# Altium project LimeSDR-XTRX_1v2.PrjPcb (part 7 of 9)
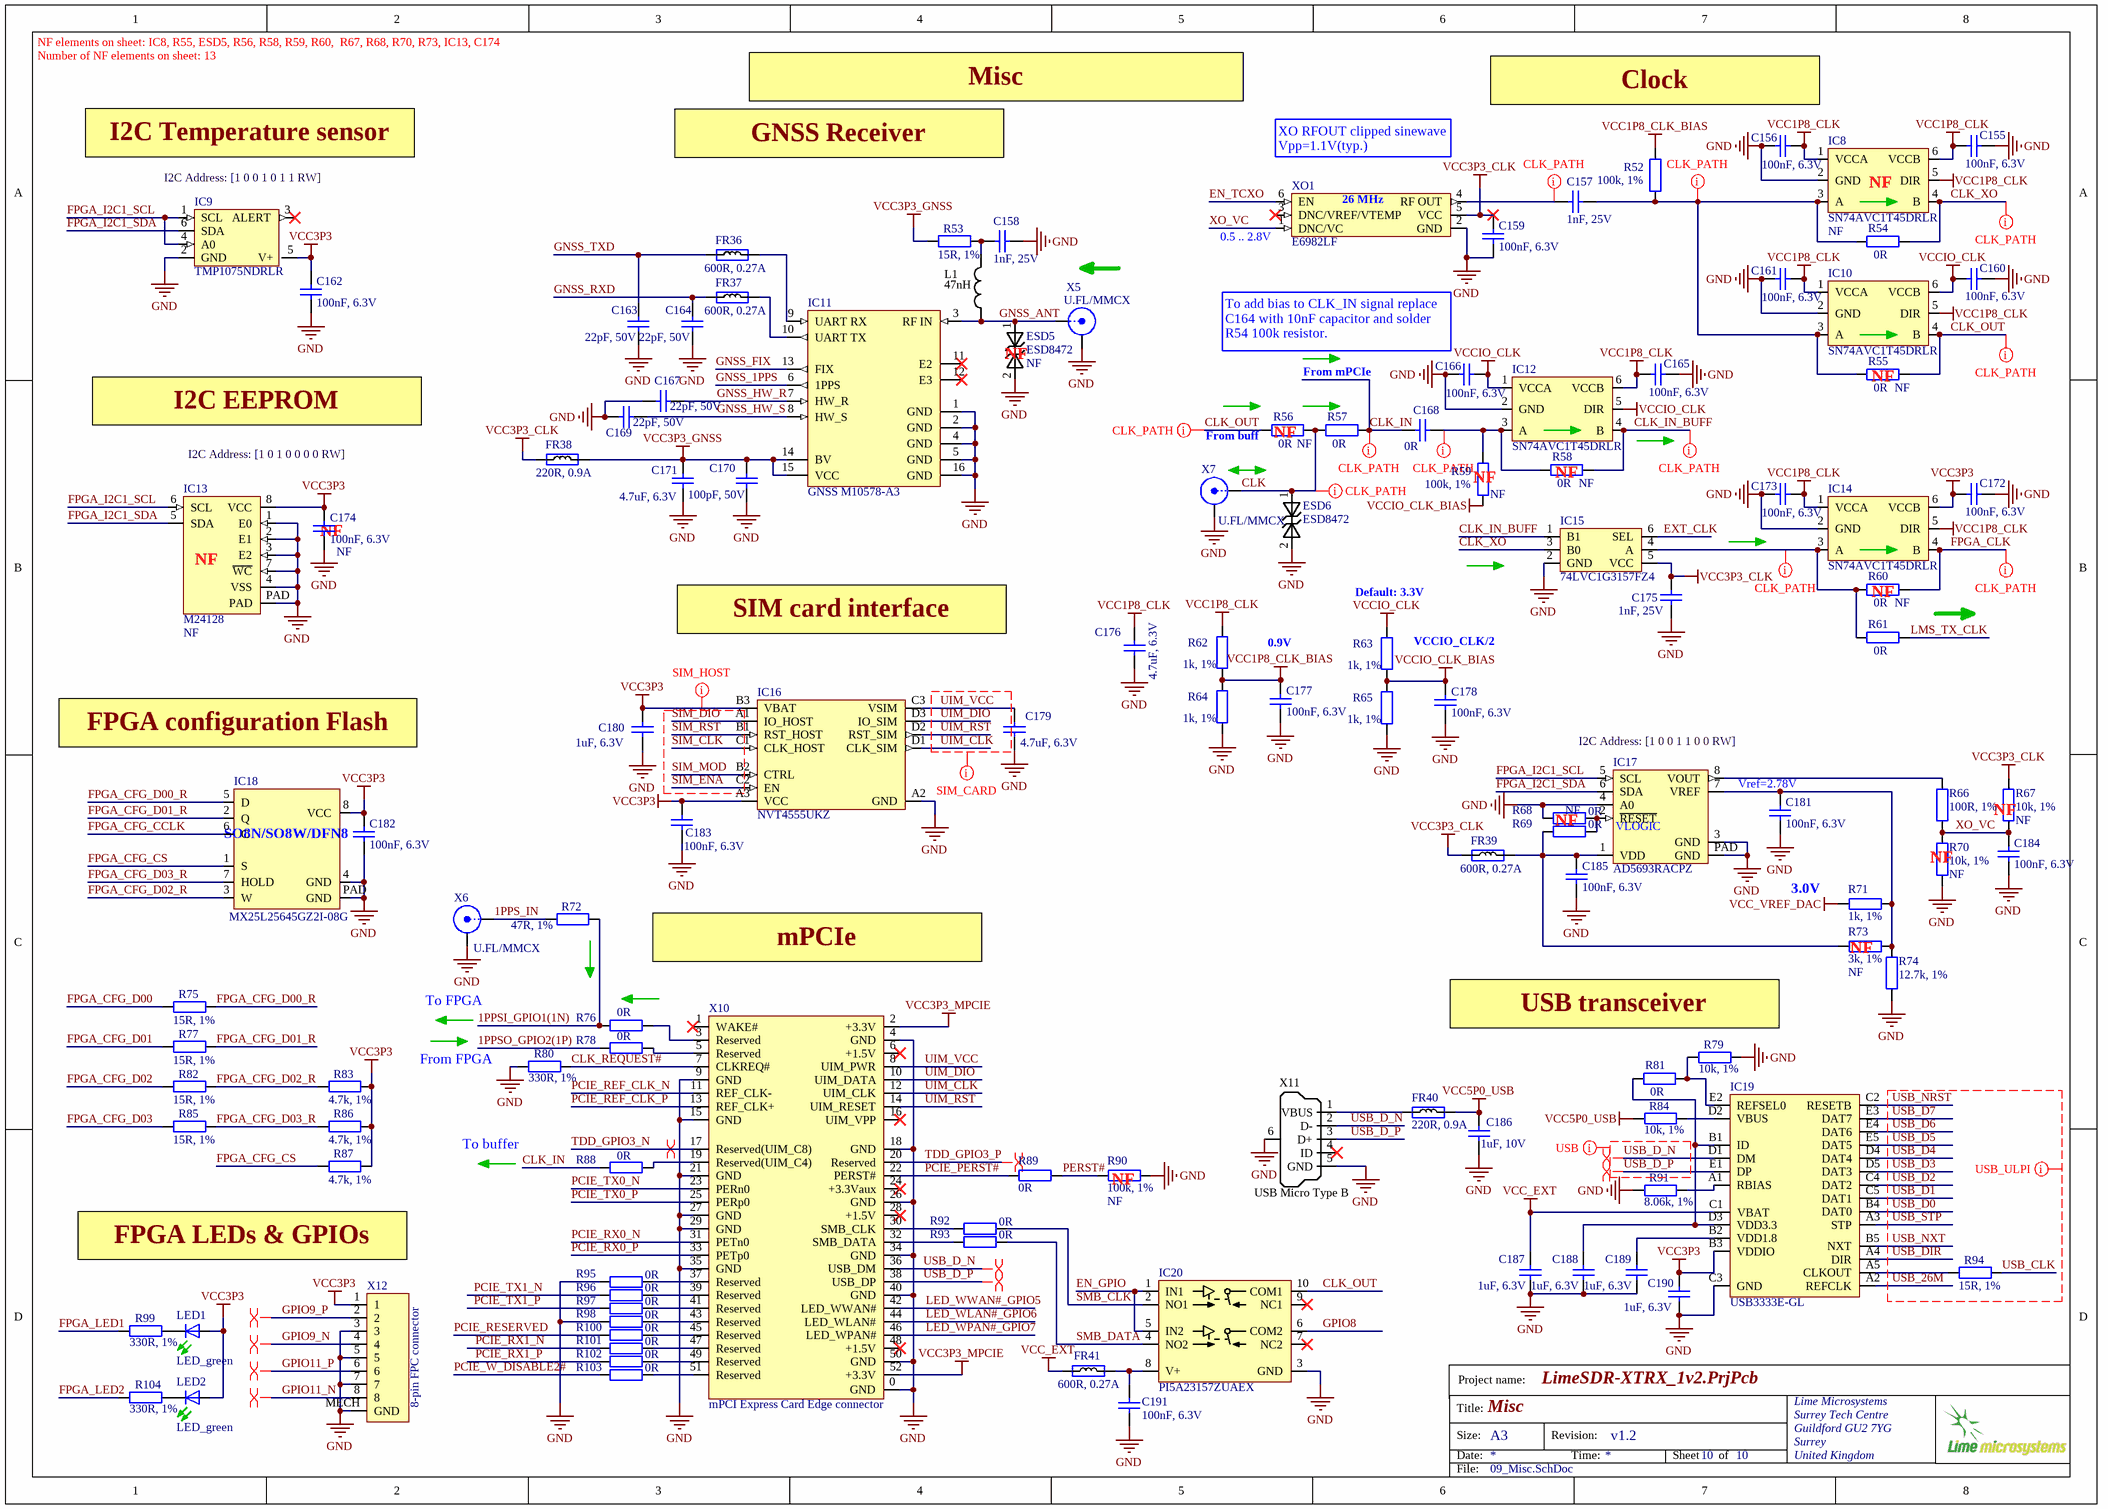
[diagram p111: 09_Misc.SchDoc]

## Sheet 09_Misc.SchDoc: Misc (continued)

### Library data of the parts (continued)
R91 = Res_0402: Manufacturer: Yageo; Manufacturer Part Number 1: RC0201FR-078K06L; Part Description: 8.06 kOhms ±1% 0.05W, 1/20W Chip Resistor 0201 (0603 Metric) Moisture Resistant Thick Film; Resistance: 8.06kR; Max Power Dissipation: 50mW; Temperature Coefficient: 200ppm/°C; Value: 8.06k, 1%; ComponentLink1URL: https://datasheet.ciiva.com/5924/1563626-5924912.pdf?src-supplier=Farnell; ComponentLink1Description: https://datasheet.ciiva.com/5924/1563626-5924912.pdf?src-supplier=Farnell; ComponentLink2URL: https://datasheet.ciiva.com/22661/1563626-22661319.pdf?src-supplier=Element14; ComponentLink2Description: https://datasheet.ciiva.com/22661/1563626-22661319.pdf?src-supplier=Element14; ComponentLink3URL: https://datasheet.ciiva.com/7660/1421516-7660807.pdf?src-supplier=Element14; ComponentLink3Description: https://datasheet.ciiva.com/7660/1421516-7660807.pdf?src-supplier=Element14; ComponentLink4URL: https://datasheet.ciiva.com/46391/1421516-46391339.pdf?src-supplier=Element14; ComponentLink4Description: https://datasheet.ciiva.com/46391/1421516-46391339.pdf?src-supplier=Element14; ComponentLink5URL: https://datasheet.ciiva.com/2467/pyu-r-int-thick-7-2467110.pdf?src-supplier=Digi-Key; ComponentLink5Description: https://datasheet.ciiva.com/2467/pyu-r-int-thick-7-2467110.pdf?src-supplier=Digi-Key; ComponentLink6URL: https://datasheet.ciiva.com/2467/pyu-r-int-thick-7-2467111.pdf?src-supplier=Digi-Key; ComponentLink6Description: https://datasheet.ciiva.com/2467/pyu-r-int-thick-7-2467111.pdf?src-supplier=Digi-Key; ComponentLink7URL: https://datasheet.ciiva.com/2467/pyu-r-int-thick-7-2467109.pdf?src-supplier=Digi-Key; ComponentLink7Description: https://datasheet.ciiva.com/2467/pyu-r-int-thick-7-2467109.pdf?src-supplier=Digi-Key; Supplier 1: Digi-Key; Supplier Part Number 1: YAG2831CT-ND; Stock 1: 99747; Pricing 1: 1=0,10000, 10=0,03700, 100=0,01500, 1000=0,00672, 2500=0,00583, 5000=0,00482 (USD); RoHS: Yes; Case/Package: 0201; Case Code (Metric): 0603; Case Code (Imperial): 0201; Min Operating Temperature: -55°C; Max Operating Temperature: 125°C; Tolerance: 1%; Packaging: Tape and Reel; Resistor Type: Thick Film; Number of Terminations: 2; Features: Moisture Resistant; Length: 0.024inch; Width: 0.012inch; Height: 0.01inch; Depth: 0.3mm; Military Standard: Not; RoHS Compliant: Yes; ComponentLink8URL: http://www.yageo.com/documents/recent/PYu-RC_Group_51_RoHS_L_9.pdf?src-supplier=Digi-Key; ComponentLink8Description: http://www.yageo.com/documents/recent/PYu-RC_Group_51_RoHS_L_9.pdf?src-supplier=Digi-Key; ComponentLink9URL: https://www.yageo.com/upload/media/product/productsearch/datasheet/rchip/PYu-RC_Group_51_RoHS_L_11.pdf?src-supplier=Digi-Key; ComponentLink9Description: https://www.yageo.com/upload/media/product/productsearch/datasheet/rchip/PYu-RC_Group_51_RoHS_L_11.pdf?src-supplier=Digi-Key
X5-X7 = RF_IF_connector: CONN UMC RCPT STR 50 OHM SMD; Manufacturer: Molex, LLC; Manufacturer Part Number 1: 0734120110; Part Description: Ultra Miniature Coaxial Connector Receptacle, Male Pin 50 Ohm Surface Mount Solder; Body Finish: Nickel; Body Material: Phosphor Bronze; Center Contact Material: Brass; Center Contact Plating: Gold; Connector Style: Ultra Miniature Coaxial; Connector Type: Jack, Male Pin; Contact Termination: Solder; Dielectric Material: Liquid Crystal Polymer (LCP); Frequency - Max: 6GHz; Impedance: 50 Ohm; Voltage Rating: 60V; Cable Group: -; Category: Connectors, Interconnects; Fastening Type: Snap-On; Features: -; Housing Color: Silver; Ingress Protection: -; Mounting Type: Surface Mount; Operating Temperature: -40°C ~ 90°C; Packaging: Cut Tape (CT); RoHS: RoHS Compliant; Shield Termination: Solder; Supplier 1: Digi-Key; Supplier Part Number 1: WM5587CT-ND
X10 = PCIe_MiniCard_fingers: PCIe MiniCard full or half size
X11 = USB_Micro_TypeB_47346-0001: Connector SMD USB Micro Type B; Part Description: USB - micro B USB 2.0 Receptacle Connector 5 Position Surface Mount, Right Angle; Manufacturer: Molex; Supplier 1: Digi-Key; Supplier Part Number 1: WM17141CT-ND; Manufacturer Part Number 1: 47346-0001; Stock 1: 48746; Pricing 1: 1=1,66000, 10=1,41200, 100=1,16660, 1000=0,92100 (USD); RoHS: Yes; ComponentLink1URL: https://datasheet.ciiva.com/30075/304740473460001-io-nectors-30075527.pdf?src-supplier=Onlinecomponents.com; ComponentLink1Description: https://datasheet.ciiva.com/30075/304740473460001-io-nectors-30075527.pdf?src-supplier=Onlinecomponents.com; ComponentLink2URL: https://datasheet.ciiva.com/22654/1630785-22654942.pdf?src-supplier=Element14; ComponentLink2Description: https://datasheet.ciiva.com/22654/1630785-22654942.pdf?src-supplier=Element14; ComponentLink3URL: https://datasheet.ciiva.com/16148/1700180473460001-io-nectors-16148917.pdf?src-supplier=Onlinecomponents.com; ComponentLink3Description: https://datasheet.ciiva.com/16148/1700180473460001-io-nectors-16148917.pdf?src-supplier=Onlinecomponents.com; ComponentLink4URL: https://datasheet.ciiva.com/11731/0900766b80dfe0a7-11731298.pdf?src-supplier=RSComponents; ComponentLink4Description: https://datasheet.ciiva.com/11731/0900766b80dfe0a7-11731298.pdf?src-supplier=RSComponents; ComponentLink5URL: https://datasheet.ciiva.com/1098/1698067-1098476.pdf?src-supplier=Element14; ComponentLink5Description: https://datasheet.ciiva.com/1098/1698067-1098476.pdf?src-supplier=Element14; ComponentLink6URL: https://datasheet.ciiva.com/4598/0473460001-io-connectors-146446-4598841.pdf?src-supplier=Mouser; ComponentLink6Description: https://datasheet.ciiva.com/4598/0473460001-io-connectors-146446-4598841.pdf?src-supplier=Mouser; ComponentLink7URL: https://datasheet.ciiva.com/28504/0473460001-io-connectors-28504587.pdf?src-supplier=Element14; ComponentLink7Description: https://datasheet.ciiva.com/28504/0473460001-io-connectors-28504587.pdf?src-supplier=Element14; ComponentLink8URL: https://datasheet.ciiva.com/46390/1681853-46390956.pdf?src-supplier=Element14; ComponentLink8Description: https://datasheet.ciiva.com/46390/1681853-46390956.pdf?src-supplier=Element14; ComponentLink9URL: https://datasheet.ciiva.com/16986/70266948-16986683.pdf?src-supplier=Allied+Electronics; ComponentLink9Description: https://datasheet.ciiva.com/16986/70266948-16986683.pdf?src-supplier=Allied+Electronics
X12 = 503480-0800_8PIN_FPC_CONN: Part Description: 8 Position FFC, FPC Connector Contacts, Top and Bottom 0.020" (0.50mm) Surface Mount, Right Angle; Manufacturer: Molex; Supplier 1: Digi-Key; Supplier Part Number 1: WM1388CT-ND; Manufacturer Part Number 1: 503480-0800; Stock 1: 119007; Pricing 1: 1=0,92000, 10=0,76100, 100=0,63420, 1000=0,50736 (USD); RoHS: Yes; ComponentLink1URL: https://datasheet.ciiva.com/671/5034800400-sd-671136.pdf?src-supplier=Digi-Key; ComponentLink1Description: https://datasheet.ciiva.com/671/5034800400-sd-671136.pdf?src-supplier=Digi-Key; ComponentLink2URL: https://datasheet.ciiva.com/5751/1631789-5751170.pdf?src-supplier=Farnell; ComponentLink2Description: https://datasheet.ciiva.com/5751/1631789-5751170.pdf?src-supplier=Farnell; ComponentLink3URL: https://datasheet.ciiva.com/10363/5034800800-ffc-fpc-connectors-10363985.pdf?src-supplier=Avnet; ComponentLink3Description: https://datasheet.ciiva.com/10363/5034800800-ffc-fpc-connectors-10363985.pdf?src-supplier=Avnet; ComponentLink4URL: https://datasheet.ciiva.com/5138/5034800800-ffc-fpc-connectors-179547-5138276.pdf?src-supplier=Mouser; ComponentLink4Description: https://datasheet.ciiva.com/5138/5034800800-ffc-fpc-connectors-179547-5138276.pdf?src-supplier=Mouser; ComponentLink5URL: https://datasheet.ciiva.com/26825/getdatasheetpartid-495673-26825585.pdf?src-supplier=Verical; ComponentLink5Description: https://datasheet.ciiva.com/26825/getdatasheetpartid-495673-26825585.pdf?src-supplier=Verical
XO1 = RAKON_E8231LF_E6982LF: Part Description: 26MHz E6982LF Small Cell TCVCXO, w EN and VC, L x W: 5.0 x 3.2 mm nom., H: 2.1 mm max. (6 pad); Manufacturer: Rakon; Manufacturer Part Number 1: E6982LF; Supplier Part Number 1: E6982LF; Supplier 1: Rakon

## Sheet 10_Power.SchDoc: Power
size A3; Organization: Lime Microsystems; Address1: Surrey Tech Centre; Address2: Guildford GU2 7YG; Address3: Surrey; Address4: United Kingdom; Revision: v1.2; SheetNumber: 10; SheetTotal: 10
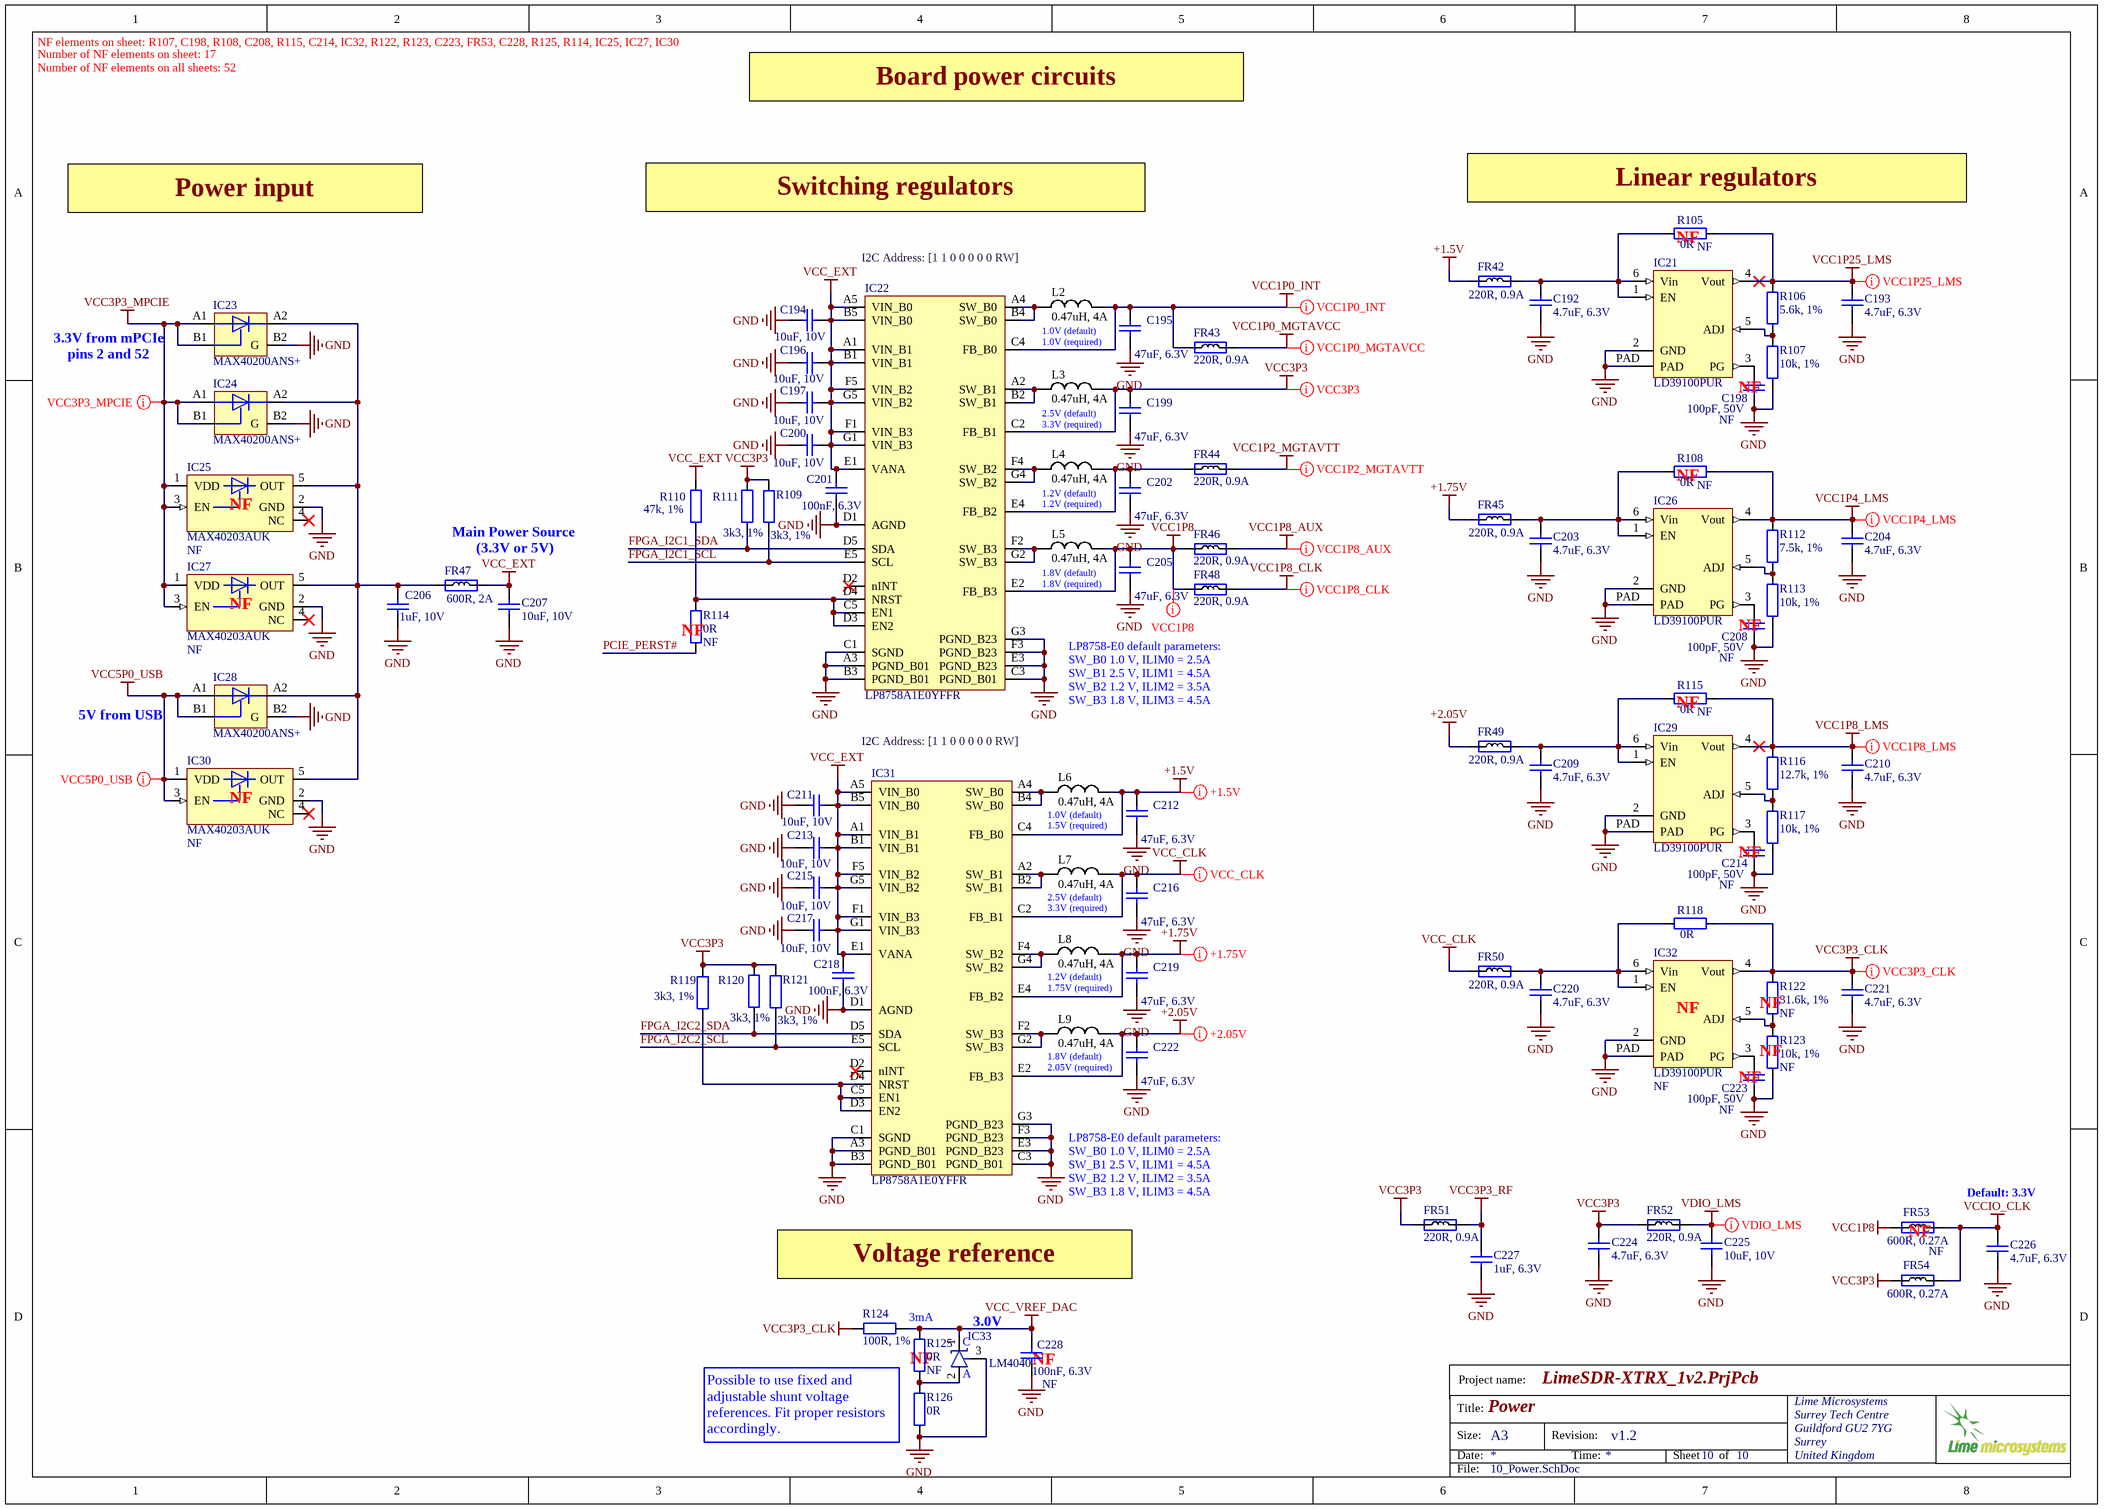
[diagram p9: 10_Power.SchDoc]

### Parts
C192  4.7uF, 6.3V  [CAP0402]
C193  4.7uF, 6.3V  [CAP0402]
C194  10uF, 10V  [CAP0603]
C195  47uF, 6.3V  [CAP0603]
C196  10uF, 10V  [CAP0603]
C197  10uF, 10V  [CAP0603]
C198  100pF, 50V  Assembly Info: NF  [CAP0201]
C199  47uF, 6.3V  [CAP0603]
C200  10uF, 10V  [CAP0603]
C201  100nF, 6.3V  [CAP0201]
C202  47uF, 6.3V  [CAP0603]
C203  4.7uF, 6.3V  [CAP0402]
C204  4.7uF, 6.3V  [CAP0402]
C205  47uF, 6.3V  [CAP0603]
C206  1uF, 10V  [CAP0402]
C207  10uF, 10V  [CAP0603]
C208  100pF, 50V  Assembly Info: NF  [CAP0201]
C209  4.7uF, 6.3V  [CAP0402]
C210  4.7uF, 6.3V  [CAP0402]
C211  10uF, 10V  [CAP0603]
C212  47uF, 6.3V  [CAP0603]
C213  10uF, 10V  [CAP0603]
C214  100pF, 50V  Assembly Info: NF  [CAP0201]
C215  10uF, 10V  [CAP0603]
C216  47uF, 6.3V  [CAP0603]
C217  10uF, 10V  [CAP0603]
C218  100nF, 6.3V  [CAP0201]
C219  47uF, 6.3V  [CAP0603]
C220  4.7uF, 6.3V  [CAP0402]
C221  4.7uF, 6.3V  [CAP0402]
C222  47uF, 6.3V  [CAP0603]
C223  100pF, 50V  Assembly Info: NF  [CAP0201]
C224  4.7uF, 6.3V  [CAP0402]
C225  10uF, 10V  [CAP0603]
C226  4.7uF, 6.3V  [CAP0402]
C227  1uF, 6.3V  [CAP0201]
C228  100nF, 6.3V  Assembly Info: NF  [CAP0201]
FR42  220R, 0.9A  [RES0402]
FR43  220R, 0.9A  [RES0402]
FR44  220R, 0.9A  [RES0402]
FR45  220R, 0.9A  [RES0402]
FR46  220R, 0.9A  [RES0402]
FR47  600R, 2A  [RES0805]
FR48  220R, 0.9A  [RES0402]
FR49  220R, 0.9A  [RES0402]
FR50  220R, 0.9A  [RES0402]
FR51  220R, 0.9A  [RES0402]
FR52  220R, 0.9A  [RES0402]
FR53  Assembly Info: NF  [RES0201]  (hidden comment: 600R, 0.27A)
FR54  600R, 0.27A  [RES0201]
IC21  LD39100PUR  [LD39100PUR]
IC22  LP8758A1E0YFFR  [LP8758A1E0YFFR_QUAD_DC-DC_35DSBGA]
IC23  MAX40200ANS+  [MAX40200ANS+_IDEAL_DIODE_4WLP]
IC24  MAX40200ANS+  [MAX40200ANS+_IDEAL_DIODE_4WLP]
IC25  MAX40203AUK  Assembly Info: NF  [SOT23-5_v1]
IC26  LD39100PUR  [LD39100PUR]
IC27  MAX40203AUK  Assembly Info: NF  [SOT23-5_v1]
IC28  MAX40200ANS+  [MAX40200ANS+_IDEAL_DIODE_4WLP]
IC29  LD39100PUR  [LD39100PUR]
IC30  MAX40203AUK  Assembly Info: NF  [SOT23-5_v1]
IC31  LP8758A1E0YFFR  [LP8758A1E0YFFR_QUAD_DC-DC_35DSBGA]
IC32  LD39100PUR  Assembly Info: NF  [LD39100PUR]
IC33  LM4040  [SOT23-3_v3]
L2  0.47uH, 4A  [IND0806]
L3  0.47uH, 4A  [IND0806]
L4  0.47uH, 4A  [IND0806]
L5  0.47uH, 4A  [IND0806]
L6  0.47uH, 4A  [IND0806]
L7  0.47uH, 4A  [IND0806]
L8  0.47uH, 4A  [IND0806]
L9  0.47uH, 4A  [IND0806]
R105  0R  Assembly Info: NF  [RES0201]
R106  5.6k, 1%  [RES0201]
R107  10k, 1%  [RES0201]
R108  0R  Assembly Info: NF  [RES0201]
R109  3k3, 1%  [RES0201]
R110  47k, 1%  [RES0201]
R111  3k3, 1%  [RES0201]
R112  7.5k, 1%  [RES0201]
R113  10k, 1%  [RES0201]
R114  0R  Assembly Info: NF  [RES0201]
R115  0R  Assembly Info: NF  [RES0201]
R116  12.7k, 1%  [RES0201]
R117  10k, 1%  [RES0201]
R118  0R  [RES0201]
R119  3k3, 1%  [RES0201]
R120  3k3, 1%  [RES0201]
R121  3k3, 1%  [RES0201]
R122  31.6k, 1%  Assembly Info: NF  [RES0201]
R123  10k, 1%  Assembly Info: NF  [RES0201]
R124  100R, 1%  [RES0201]
R125  0R  Assembly Info: NF  [RES0201]
R126  0R  [RES0201]

### Nets
+1.5V: C212.2 FR42.1 IC31.C4(FB_B0) L6.2
+1.75V: C219.2 FR45.1 IC31.E4(FB_B2) L8.2
+2.05V: C222.2 FR49.1 IC31.E2(FB_B3) L9.2
GND: C192.1 C193.1 C194.1 C195.1 C196.1 C197.1 C198.1 C199.1 C200.1 C201.2 C202.1 C203.1 C204.1 C205.1 C206.1 C207.1 C208.1 C209.1 C210.1 C211.1 C212.1 C213.1 C214.1 C215.1 C216.1 C217.1 C218.2 C219.1 C220.1 C221.1 C222.1 C223.1 C224.1 C225.1 C226.1 C227.2 C228.2 IC21.2(GND) IC21.PAD IC22.A3(PGND_B01) IC22.B3(PGND_B01) IC22.C1(SGND) IC22.C3(PGND_B01) IC22.D1(AGND) IC22.E3(PGND_B23) IC22.F3(PGND_B23) IC22.G3(PGND_B23) IC23.B2(G) IC24.B2(G) IC25.2(GND) IC26.2(GND) IC26.PAD IC27.2(GND) IC28.B2(G) IC29.2(GND) IC29.PAD IC30.2(GND) IC31.A3(PGND_B01) IC31.B3(PGND_B01) IC31.C1(SGND) IC31.C3(PGND_B01) IC31.D1(AGND) IC31.E3(PGND_B23) IC31.F3(PGND_B23) IC31.G3(PGND_B23) IC32.2(GND) IC32.PAD IC33.3(NC/A) R107.2 R113.2 R117.2 R123.2 R126.2
VCC1P0_INT: C195.2 FR43.1 IC22.C4(FB_B0) L2.2
VCC1P0_MGTAVCC: FR43.2
VCC1P2_MGTAVTT: FR44.2
VCC1P4_LMS: C204.2 IC26.4(Vout) R108.2 R112.1
VCC1P8: C205.2 FR46.1 FR48.1 FR53.1 IC22.E2(FB_B3) L5.2
VCC1P8_AUX: FR46.2
VCC1P8_CLK: FR48.2
VCC1P8_LMS: C210.2 IC29.4(Vout) R115.2 R116.1
VCC1P25_LMS: C193.2 IC21.4(Vout) R105.2 R106.1
VCC3P3: C199.2 C224.2 FR51.1 FR52.1 FR54.1 IC22.C2(FB_B1) L3.2 R109.1 R111.1 R119.1 R120.1 R121.1
VCC3P3_CLK: C221.2 IC32.4(Vout) R118.2 R122.1 R124.2
VCC3P3_MPCIE: IC23.A1(VDD) IC23.B1(EN) IC24.A1(VDD) IC24.B1(EN) IC25.1(VDD) IC25.3(EN) IC27.1(VDD) IC27.3(EN)
VCC3P3_RF: C227.1 FR51.2
VCC5P0_USB: IC28.A1(VDD) IC28.B1(EN) IC30.1(VDD) IC30.3(EN)
VCC_CLK: C216.2 FR50.1 IC31.C2(FB_B1) L7.2
VCC_EXT: C194.2 C196.2 C197.2 C200.2 C201.1 C207.2 C211.2 C213.2 C215.2 C217.2 C218.1 FR47.2 IC22.A1(VIN_B1) IC22.A5(VIN_B0) IC22.B1(VIN_B1) IC22.B5(VIN_B0) IC22.E1(VANA) IC22.F1(VIN_B3) IC22.F5(VIN_B2) IC22.G1(VIN_B3) IC22.G5(VIN_B2) IC31.A1(VIN_B1) IC31.A5(VIN_B0) IC31.B1(VIN_B1) IC31.B5(VIN_B0) IC31.E1(VANA) IC31.F1(VIN_B3) IC31.F5(VIN_B2) IC31.G1(VIN_B3) IC31.G5(VIN_B2) R110.1
VCC_VREF_DAC: C228.1 IC33.1(K) R124.1 R125.1
VCCIO_CLK: C226.2 FR53.2 FR54.2
VDIO_LMS: C225.2 FR52.2
FPGA_I2C1_SCL: IC22.E5(SCL) R109.2
FPGA_I2C1_SDA: IC22.D5(SDA) R111.2
FPGA_I2C2_SCL: IC31.E5(SCL) R121.2
FPGA_I2C2_SDA: IC31.D5(SDA) R120.2
PCIE_PERST#: R114.1
NetC192_2: C192.2 FR42.2 IC21.1(EN) IC21.6(Vin) R105.1
NetC198_2: C198.2 IC21.3(PG)
NetC202_2: C202.2 FR44.1 IC22.E4(FB_B2) L4.2
NetC203_2: C203.2 FR45.2 IC26.1(EN) IC26.6(Vin) R108.1
NetC206_2: C206.2 FR47.1 IC23.A2(OUT) IC24.A2(OUT) IC25.5(OUT) IC27.5(OUT) IC28.A2(OUT) IC30.5(OUT)
NetC208_2: C208.2 IC26.3(PG)
NetC209_2: C209.2 FR49.2 IC29.1(EN) IC29.6(Vin) R115.1
NetC214_2: C214.2 IC29.3(PG)
NetC220_2: C220.2 FR50.2 IC32.1(EN) IC32.6(Vin) R118.1
NetC223_2: C223.2 IC32.3(PG)
NetIC21_5: IC21.5(ADJ) R106.2 R107.1
NetIC22_A2: IC22.A2(SW_B1) IC22.B2(SW_B1) L3.1
NetIC22_A4: IC22.A4(SW_B0) IC22.B4(SW_B0) L2.1
NetIC22_C5: IC22.C5(EN1) IC22.D3(EN2) IC22.D4(NRST) R110.2 R114.2
NetIC22_F2: IC22.F2(SW_B3) IC22.G2(SW_B3) L5.1
NetIC22_F4: IC22.F4(SW_B2) IC22.G4(SW_B2) L4.1
NetIC26_5: IC26.5(ADJ) R112.2 R113.1
NetIC29_5: IC29.5(ADJ) R116.2 R117.1
NetIC31_A2: IC31.A2(SW_B1) IC31.B2(SW_B1) L7.1
NetIC31_A4: IC31.A4(SW_B0) IC31.B4(SW_B0) L6.1
NetIC31_C5: IC31.C5(EN1) IC31.D3(EN2) IC31.D4(NRST) R119.2
NetIC31_F2: IC31.F2(SW_B3) IC31.G2(SW_B3) L9.1
NetIC31_F4: IC31.F4(SW_B2) IC31.G4(SW_B2) L8.1
NetIC32_5: IC32.5(ADJ) R122.2 R123.1
NetIC33_2: IC33.2(A) R125.2 R126.1

Not connected (* = marked no-connect by the designer): IC22 D2(nINT)*; IC25 4(NC)*; IC27 4(NC)*; IC30 4(NC)*; IC31 D2(nINT)*

### Layout directives
net class VDIO_LMS: VDIO_LMS
net class VCC1P25_LMS: VCC1P25_LMS
net class VCC1P4_LMS: VCC1P4_LMS
net class VCC1P8_LMS: VCC1P8_LMS
net class VCC3P3_CLK: VCC3P3_CLK
net class +1.5V: +1.5V
net class VCC_CLK: VCC_CLK
net class +1.75V: +1.75V
net class +2.05V: +2.05V
net class VCC1P8_AUX: VCC1P8_AUX
net class VCC1P2_MGTAVTT: VCC1P2_MGTAVTT
net class VCC3P3: VCC3P3
net class VCC1P0_MGTAVCC: VCC1P0_MGTAVCC
net class VCC1P0_INT: VCC1P0_INT
net class VCC3P3_MPCIE: VCC3P3_MPCIE
net class VCC5P0_USB: VCC5P0_USB
net class VCC1P8_CLK: VCC1P8, VCC1P8_CLK

### Notes on the sheet
- NF elements on sheet: R107, C198, R108, C208, R115, C214, IC32, R122, R123, C223, FR53, C228, R125, R114, IC25, IC27, IC30
- Number of NF elements on sheet: 17
- Number of NF elements on all sheets: 52
- Board power circuits
- Power input
- Switching regulators
- (near R105) Linear regulators
- (near R105) NF
- I2C Address: [1 1 0 0 0 0 0 RW]
- 3.3V from mPCIe pins 2 and 52
- 1.0V (default)
  1.0V (required)
- 2.5V (default)
  3.3V (required)
- NF
- (near IC25) NF
- 1.2V (default)
  1.2V (required)
- (near R108) NF
- (near FR47) Main Power Source
  (3.3V or 5V)
- 1.8V (default)
  1.8V (required)
- (near IC27) NF
- (near R114) NF
- LP8758-E0 default parameters:
  SW_B0 1.0 V, ILIM0 = 2.5A
  SW_B1 2.5 V, ILIM1 = 4.5A
  SW_B2 1.2 V, ILIM2 = 3.5A
  SW_B3 1.8 V, ILIM3 = 4.5A
- (near R115) NF
- 5V from USB
- (near IC30) NF
- 1.0V (default)
  1.5V (required)
- 1.2V (default)
  1.75V (required)
- (near IC32) NF
- (near R123) NF
- (near R122) NF
- 1.8V (default)
  2.05V (required)
- (near FR53) NF
- Default: 3.3V
- Voltage reference
- 3mA
- 3.0V
- (near R125) NF
- (near IC33) A
- (near IC33) C
- (near C228) NF
- Possible to use fixed and adjustable shunt voltage references. Fit proper resistors accordingly.
- Project name:
- Title:
- Size:
- Date:
- A3
- Revision:
- Time:
- Sheet
- of
- File: